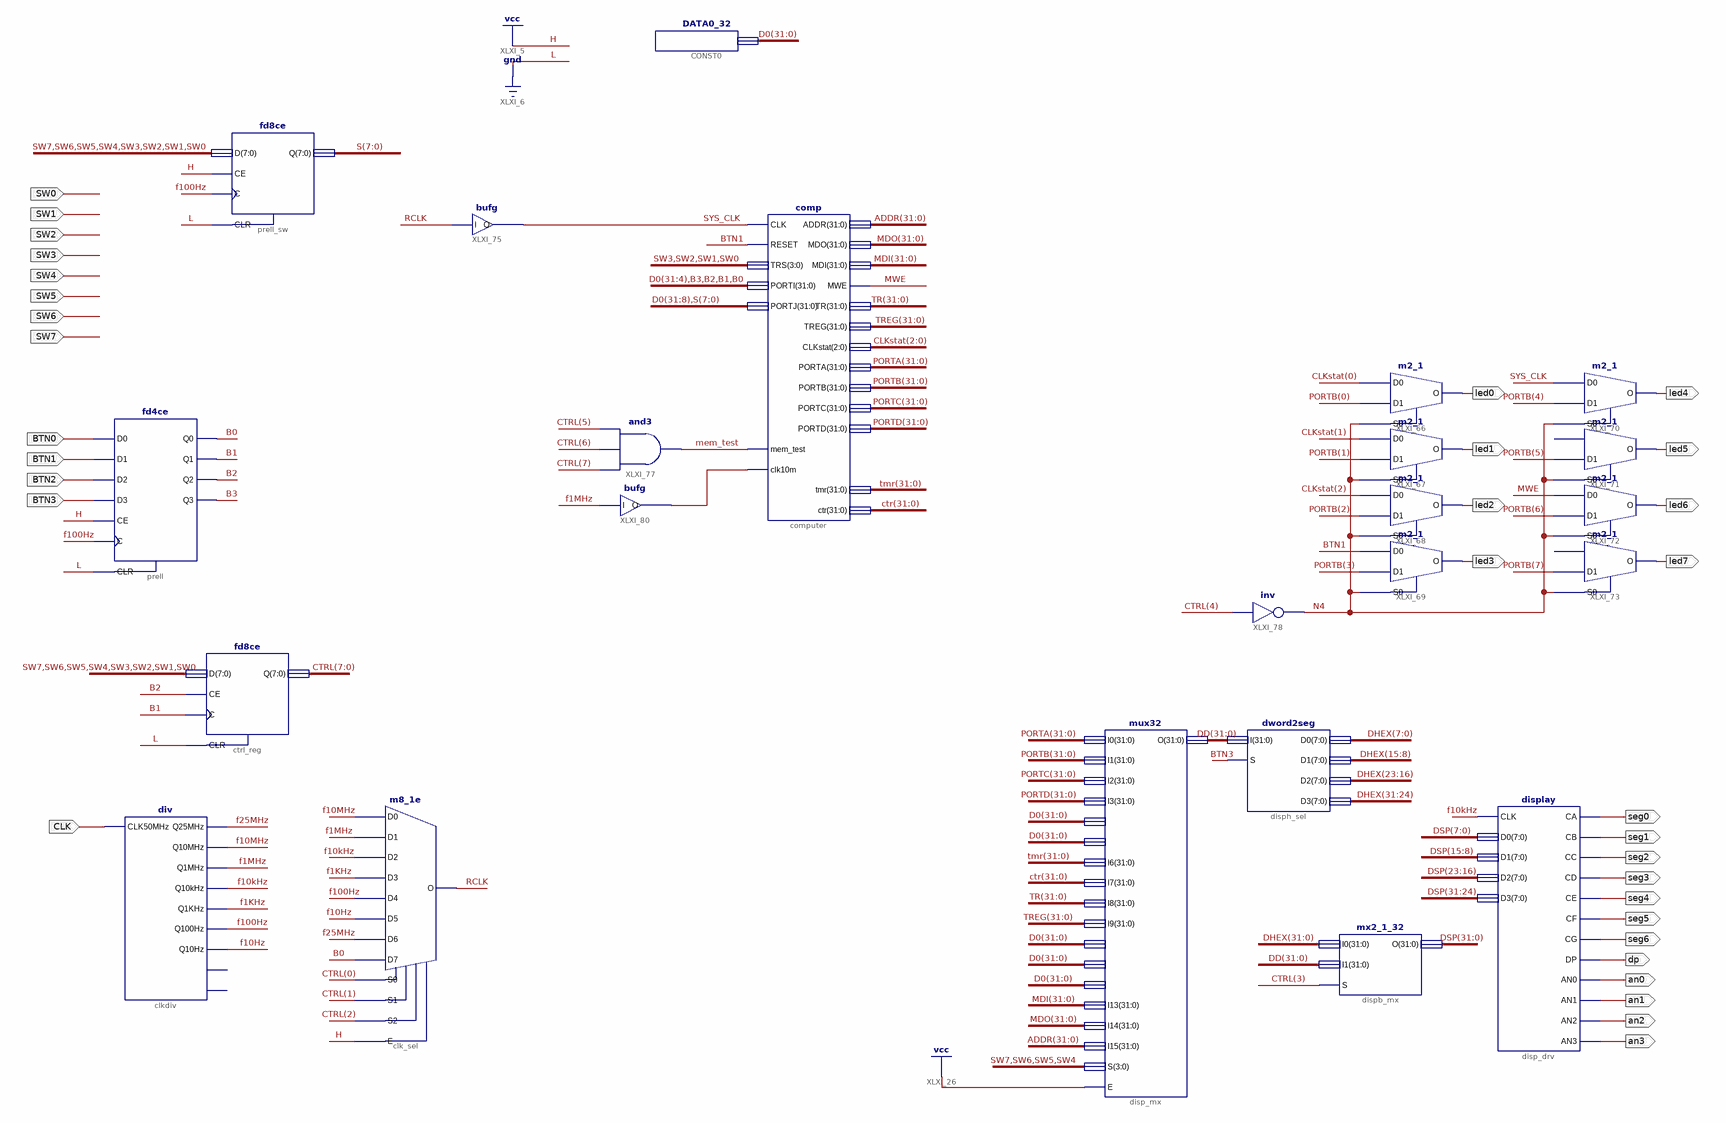
[diagram p0: schematic sheet 1]
// Xilinx ISE schematic comptest_n2.sch (spartan3e) as structural Verilog: 23 symbols, 33 ports
module comptest_n2 (
  input  SW3,
  input  BTN0,
  input  BTN1,
  input  SW2,
  input  SW1,
  input  SW0,
  input  BTN3,
  input  SW4,
  input  SW5,
  input  SW6,
  input  SW7,
  input  BTN2,
  input  CLK,
  output seg0,
  output seg1,
  output seg2,
  output seg3,
  output seg4,
  output seg5,
  output seg6,
  output dp,
  output an0,
  output an1,
  output an2,
  output an3,
  output led3,
  output led2,
  output led1,
  output led0,
  output led4,
  output led5,
  output led6,
  output led7
);

  wire B0, B1, B2, B3, f1KHz, f1MHz, f10Hz, f10kHz, f10MHz, f25MHz, f100Hz, mem_test, MWE, N4, RCLK, SYS_CLK,
       XLXN_67;
  wire [2:0] CLKstat;
  wire [7:0] CTRL, S;
  wire [31:0] ADDR, ctr, D0, DD, DHEX, DSP, MDI, MDO, PORTA, PORTB, PORTC, PORTD, tmr, TR, TREG;

  display disp_drv (
    .AN0(an0), .AN1(an1), .AN2(an2), .AN3(an3), .CA(seg0), .CB(seg1), .CC(seg2), .CD(seg3), .CE(seg4),
    .CF(seg5), .CG(seg6), .CLK(f10kHz), .D0(DSP[7:0]), .D1(DSP[15:8]), .D2(DSP[23:16]), .D3(DSP[31:24]),
    .DP(dp));
  dword2seg disph_sel (.D0(DHEX[7:0]), .D1(DHEX[15:8]), .D2(DHEX[23:16]), .D3(DHEX[31:24]), .I(DD), .S(BTN3));
  mux32 disp_mx (
    .E(1'b1), .I0(PORTA), .I1(PORTB), .I10(D0), .I11(D0), .I12(D0), .I13(MDI), .I14(MDO), .I15(ADDR),
    .I2(PORTC), .I3(PORTD), .I4(D0), .I5(D0), .I6(tmr), .I7(ctr), .I8(TR), .I9(TREG), .O(DD),
    .S({SW7, SW6, SW5, SW4}));
  DATA0_32 CONST0 (.O(D0));
  fd4ce prell (
    .C(f100Hz), .CE(1'b1), .CLR(1'b0), .D0(BTN0), .D1(BTN1), .D2(BTN2), .D3(BTN3), .Q0(B0), .Q1(B1), .Q2(B2),
    .Q3(B3));
  m8_1e clk_sel (
    .D0(f10MHz), .D1(f1MHz), .D2(f10kHz), .D3(f1KHz), .D4(f100Hz), .D5(f10Hz), .D6(f25MHz), .D7(B0),
    .E(1'b1), .S0(CTRL[0]), .S1(CTRL[1]), .S2(CTRL[2]), .O(RCLK));
  mx2_1_32 dispb_mx (.S(CTRL[3]), .I0(DHEX), .I1(DD), .O(DSP));
  div clkdiv (
    .CLK50MHz(CLK), .Q100Hz(f100Hz), .Q10Hz(f10Hz), .Q10kHz(f10kHz), .Q10MHz(f10MHz), .Q1KHz(f1KHz),
    .Q1MHz(f1MHz), .Q25MHz(f25MHz));  // open: Q0Hz1, Q1Hz
  fd8ce ctrl_reg (.C(B1), .CE(B2), .CLR(1'b0), .D({SW7, SW6, SW5, SW4, SW3, SW2, SW1, SW0}), .Q(CTRL));
  m2_1 XLXI_66 (.D0(CLKstat[0]), .D1(PORTB[0]), .S0(N4), .O(led0));
  m2_1 XLXI_67 (.D0(CLKstat[1]), .D1(PORTB[1]), .S0(N4), .O(led1));
  m2_1 XLXI_68 (.D0(CLKstat[2]), .D1(PORTB[2]), .S0(N4), .O(led2));
  m2_1 XLXI_69 (.D0(BTN1), .D1(PORTB[3]), .S0(N4), .O(led3));
  m2_1 XLXI_71 (.D1(PORTB[5]), .S0(N4), .O(led5));  // open: D0
  m2_1 XLXI_72 (.D0(MWE), .D1(PORTB[6]), .S0(N4), .O(led6));
  m2_1 XLXI_70 (.D0(SYS_CLK), .D1(PORTB[4]), .S0(N4), .O(led4));
  m2_1 XLXI_73 (.D1(PORTB[7]), .S0(N4), .O(led7));  // open: D0
  fd8ce prell_sw (.C(f100Hz), .CE(1'b1), .CLR(1'b0), .D({SW7, SW6, SW5, SW4, SW3, SW2, SW1, SW0}), .Q(S));
  bufg XLXI_75 (.I(RCLK), .O(SYS_CLK));
  and XLXI_77 (mem_test, CTRL[7], CTRL[6], CTRL[5]);
  not XLXI_78 (N4, CTRL[4]);
  comp #(.PROGRAM("../counter.asc")) computer (
    .CLK(SYS_CLK), .RESET(BTN1), .mem_test(mem_test), .clk10m(XLXN_67), .PORTI({D0[31:4], B3, B2, B1, B0}),
    .PORTJ({D0[31:8], S}), .TRS({SW3, SW2, SW1, SW0}), .MWE(MWE), .PORTA(PORTA), .PORTB(PORTB),
    .PORTC(PORTC), .PORTD(PORTD), .TR(TR), .CLKstat(CLKstat), .ADDR(ADDR), .MDO(MDO), .MDI(MDI), .TREG(TREG),
    .tmr(tmr), .ctr(ctr));
  bufg XLXI_80 (.I(f1MHz), .O(XLXN_67));
endmodule
